# Altium project Battery_Balance_V1_0.PrjPcb
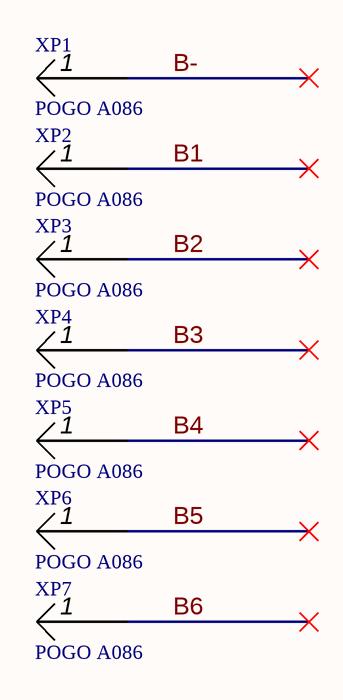
[diagram p0: main.SchDoc]
1 sheet, 7 parts. Net scope: global (net labels, ports and power ports of the same name join across sheets).
Board file: Battery_Balance_V1_0.PcbDoc

## Sheet main.SchDoc
size 209 x 297 mm; Organization: Altium Limited; Address1: L3, 12a Rodborough Rd; Address2: Frenchs Forest; Address3: NSW; Address4: Australia 2086

### Parts
XP1  POGO A086  [POGO_A086]
XP2  POGO A086  [POGO_A086]
XP3  POGO A086  [POGO_A086]
XP4  POGO A086  [POGO_A086]
XP5  POGO A086  [POGO_A086]
XP6  POGO A086  [POGO_A086]
XP7  POGO A086  [POGO_A086]

### Nets
B1: XP2.1
B2: XP3.1
B3: XP4.1
B4: XP5.1
B5: XP6.1
B6: XP7.1
B-: XP1.1

### Notes on the sheet
- Перв. примен.
- Справ. №
- Подп. и дата
- Инв. № дубл.
- Взам. инв. №
- Разраб.
- Изм.
- Лист
- № докум.
- Подп.
- Дата
- Литера
- Масса
- Масштаб
- Пров.
- Т.контр.
- Листов
- Инв. № подл.
- Н.контр.
- Утв.
- Форма 1 ГОСТ 2.104-2006
- Копировал
- Формат А4

### Library data of the parts
XP1-XP7 = POGO A086: Manufacturer: -; Part Number: POGO A086